# EAGLE design plus2 sram (EAGLE 9.0.1)
PROJECT_NAME: ZX Spectrum +2 (Grey) SRAM replacement
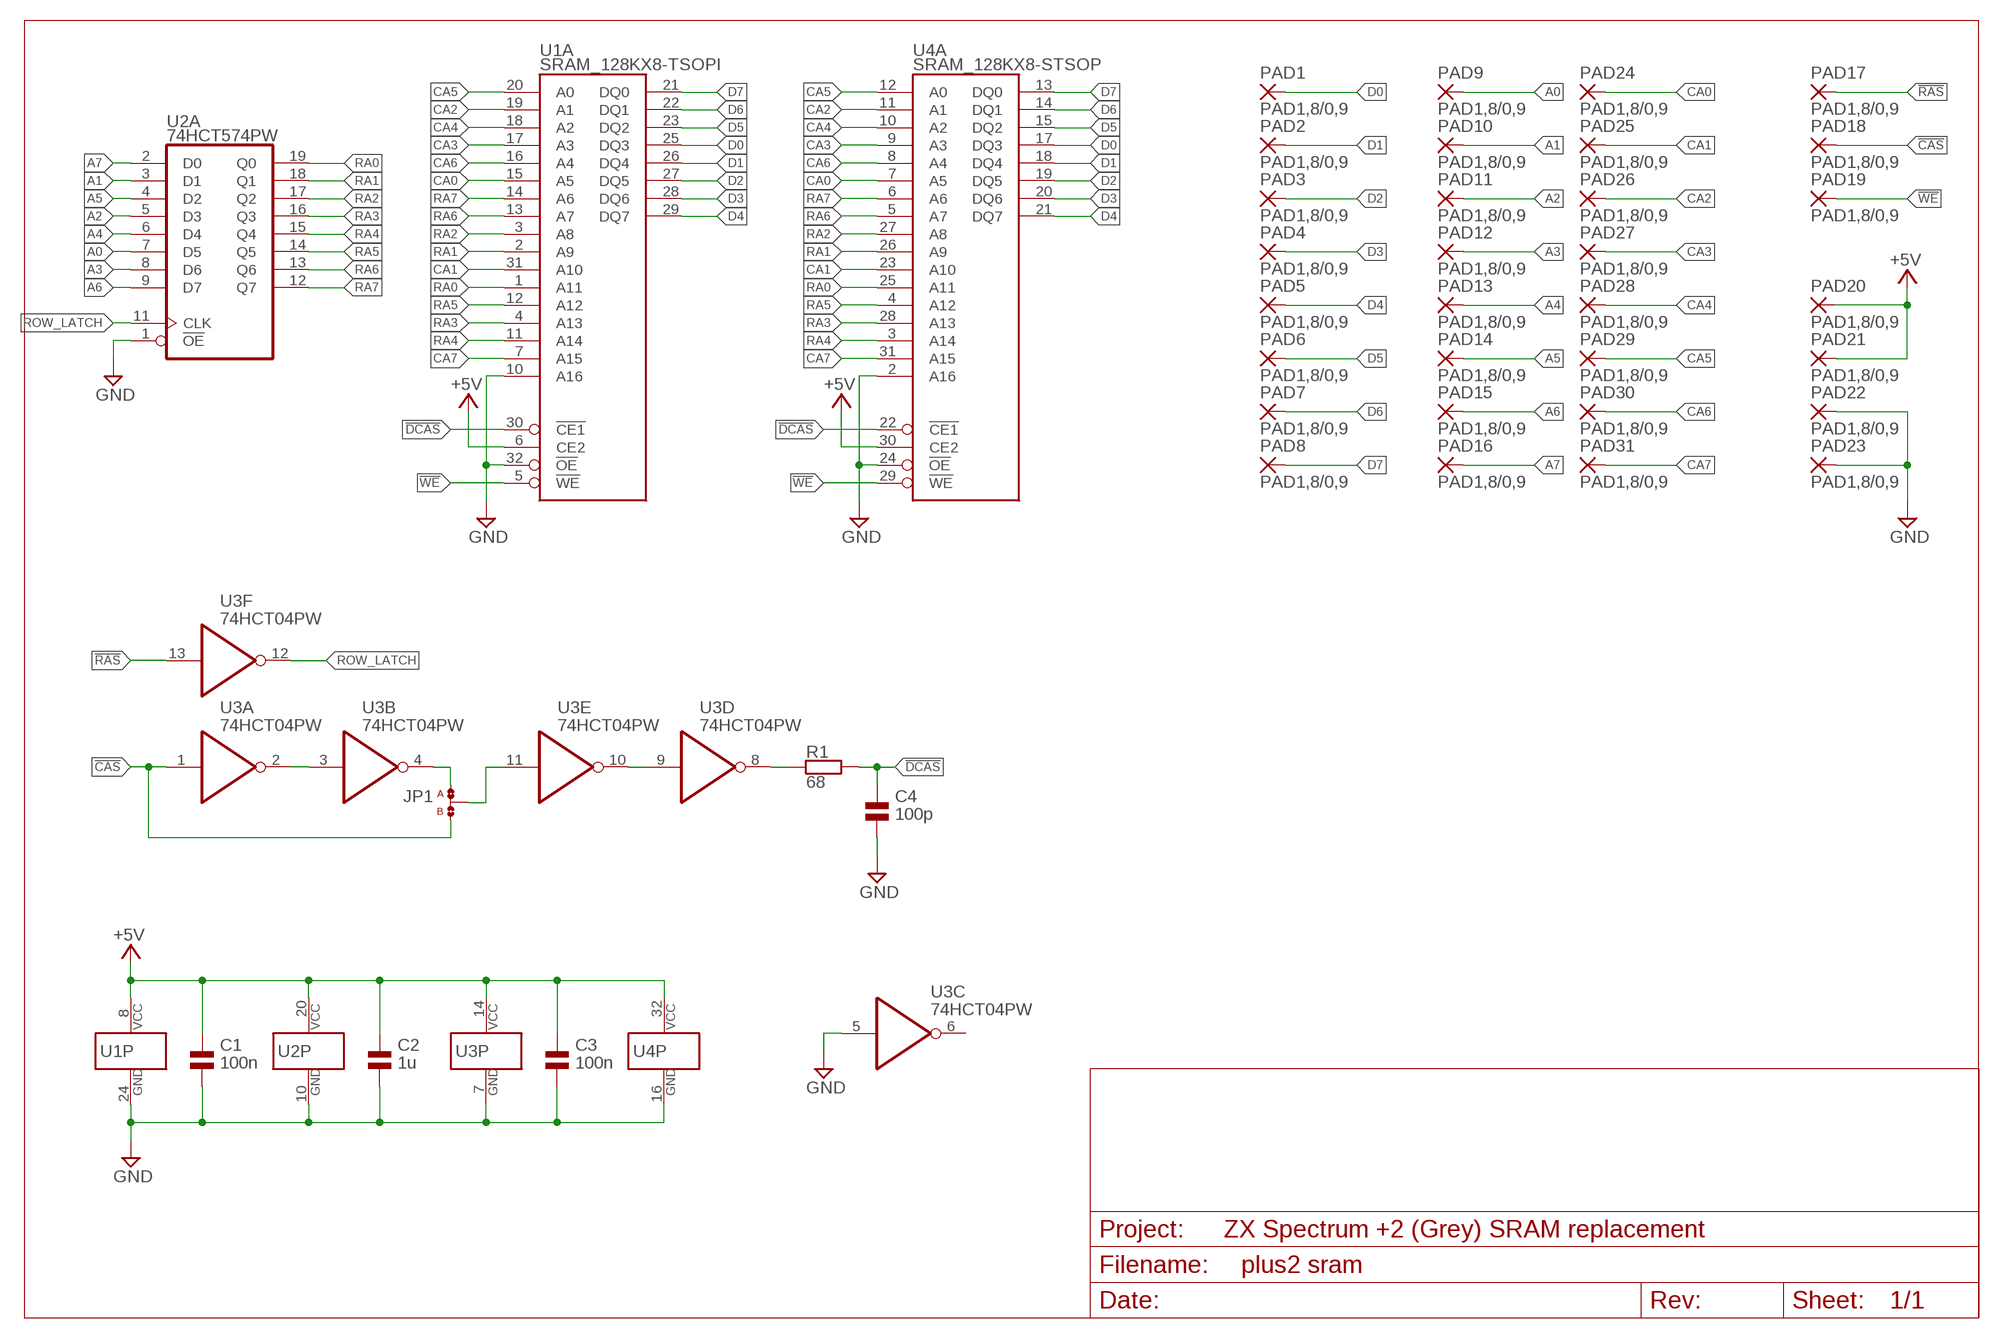
[diagram p0: schematic, sheet 1]

## Parts
C1  100n  CAP_NPOL-0603  [0603]
C2  1u  CAP_NPOL-0603  [0603]
C3  100n  CAP_NPOL-0603  [0603]
C4  100p  CAP_NPOL-0603  [0603]
JP1  JMP-SMD-3W0805  [SJ-3P-0805]
PAD1  PAD1,8/0,9  [1,8/0,9]
PAD2  PAD1,8/0,9  [1,8/0,9]
PAD3  PAD1,8/0,9  [1,8/0,9]
PAD4  PAD1,8/0,9  [1,8/0,9]
PAD5  PAD1,8/0,9  [1,8/0,9]
PAD6  PAD1,8/0,9  [1,8/0,9]
PAD7  PAD1,8/0,9  [1,8/0,9]
PAD8  PAD1,8/0,9  [1,8/0,9]
PAD9  PAD1,8/0,9  [1,8/0,9]
PAD10  PAD1,8/0,9  [1,8/0,9]
PAD11  PAD1,8/0,9  [1,8/0,9]
PAD12  PAD1,8/0,9  [1,8/0,9]
PAD13  PAD1,8/0,9  [1,8/0,9]
PAD14  PAD1,8/0,9  [1,8/0,9]
PAD15  PAD1,8/0,9  [1,8/0,9]
PAD16  PAD1,8/0,9  [1,8/0,9]
PAD17  PAD1,8/0,9  [1,8/0,9]
PAD18  PAD1,8/0,9  [1,8/0,9]
PAD19  PAD1,8/0,9  [1,8/0,9]
PAD20  PAD1,8/0,9  [1,8/0,9]
PAD21  PAD1,8/0,9  [1,8/0,9]
PAD22  PAD1,8/0,9  [1,8/0,9]
PAD23  PAD1,8/0,9  [1,8/0,9]
PAD24  PAD1,8/0,9  [1,8/0,9]
PAD25  PAD1,8/0,9  [1,8/0,9]
PAD26  PAD1,8/0,9  [1,8/0,9]
PAD27  PAD1,8/0,9  [1,8/0,9]
PAD28  PAD1,8/0,9  [1,8/0,9]
PAD29  PAD1,8/0,9  [1,8/0,9]
PAD30  PAD1,8/0,9  [1,8/0,9]
PAD31  PAD1,8/0,9  [1,8/0,9]
R1  68  RES-SMD_0603  [0603]
U1  SRAM_128KX8-TSOPI  [TSOP-I-32]
U2  74HCT574PW  [TSSOP20]
U3  74HCT04PW  [TSSOP14]
U4  SRAM_128KX8-STSOP  [STSOP-32]

## Nets
!CAS: JP1.B PAD18.1(P) U3.1(A:I)
!DCAS: C4.1 R1.2 U1.30(A:!CE1) U4.22(A:!CE1)
!RAS: PAD17.1(P) U3.13(F:I)
!WE: PAD19.1(P) U1.5(A:!WE) U4.29(A:!WE)
+5V: C1.1 C2.1 C3.1 PAD20.1(P) PAD21.1(P) U1.6(A:CE2) U1.8(P:VCC) U2.20(P:VCC) U3.14(P:VCC) U4.30(A:CE2) U4.32(P:VCC)
A0: PAD9.1(P) U2.7(A:D5)
A1: PAD10.1(P) U2.3(A:D1)
A2: PAD11.1(P) U2.5(A:D3)
A3: PAD12.1(P) U2.8(A:D6)
A4: PAD13.1(P) U2.6(A:D4)
A5: PAD14.1(P) U2.4(A:D2)
A6: PAD15.1(P) U2.9(A:D7)
A7: PAD16.1(P) U2.2(A:D0)
CA0: PAD24.1(P) U1.15(A:A5) U4.7(A:A5)
CA1: PAD25.1(P) U1.31(A:A10) U4.23(A:A10)
CA2: PAD26.1(P) U1.19(A:A1) U4.11(A:A1)
CA3: PAD27.1(P) U1.17(A:A3) U4.9(A:A3)
CA4: PAD28.1(P) U1.18(A:A2) U4.10(A:A2)
CA5: PAD29.1(P) U1.20(A:A0) U4.12(A:A0)
CA6: PAD30.1(P) U1.16(A:A4) U4.8(A:A4)
CA7: PAD31.1(P) U1.7(A:A15) U4.31(A:A15)
D0: PAD1.1(P) U1.25(A:DQ3) U4.17(A:DQ3)
D1: PAD2.1(P) U1.26(A:DQ4) U4.18(A:DQ4)
D2: PAD3.1(P) U1.27(A:DQ5) U4.19(A:DQ5)
D3: PAD4.1(P) U1.28(A:DQ6) U4.20(A:DQ6)
D4: PAD5.1(P) U1.29(A:DQ7) U4.21(A:DQ7)
D5: PAD6.1(P) U1.23(A:DQ2) U4.15(A:DQ2)
D6: PAD7.1(P) U1.22(A:DQ1) U4.14(A:DQ1)
D7: PAD8.1(P) U1.21(A:DQ0) U4.13(A:DQ0)
GND: C1.2 C2.2 C3.2 C4.2 PAD22.1(P) PAD23.1(P) U1.10(A:A16) U1.24(P:GND) U1.32(A:!OE) U2.1(A:!OE) U2.10(P:GND) U3.5(C:I) U3.7(P:GND) U4.2(A:A16) U4.16(P:GND) U4.24(A:!OE)
N$1: R1.1 U3.8(D:O)
N$2: U3.2(A:O) U3.3(B:I)
N$3: JP1.COM U3.11(E:I)
N$4: U3.9(D:I) U3.10(E:O)
N$5: JP1.A U3.4(B:O)
RA0: U1.1(A:A11) U2.19(A:Q0) U4.25(A:A11)
RA1: U1.2(A:A9) U2.18(A:Q1) U4.26(A:A9)
RA2: U1.3(A:A8) U2.17(A:Q2) U4.27(A:A8)
RA3: U1.4(A:A13) U2.16(A:Q3) U4.28(A:A13)
RA4: U1.11(A:A14) U2.15(A:Q4) U4.3(A:A14)
RA5: U1.12(A:A12) U2.14(A:Q5) U4.4(A:A12)
RA6: U1.13(A:A7) U2.13(A:Q6) U4.5(A:A7)
RA7: U1.14(A:A6) U2.12(A:Q7) U4.6(A:A6)
ROW_LATCH: U2.11(A:CLK) U3.12(F:O)
Unconnected: U3.6(C:O)

## Library data of the parts
C1-C4 = jc-passive:CAP_NPOL
JP1 = jc-jumper:JMP-SMD-3W
PAD1-PAD31 = jc-connectors:PAD: Wire PAD connect wire on PCB
R1 = jc-passive:RES
U1 U4 = jc-memories:SRAM_128KX8: 628128-type CMOS Static RAM, 1Mbit, 128kx8 Cypress CY62128 ISSI IS61C1024AL, IS64C1024AL Alliance AS6C1008 Hitachi HM62812D
U2 = jc-logic:74*574: Octal D-type flip-flop; positive edge-trigger; 3-state
U3 = jc-logic:74*04: Hex Inverters

## Board
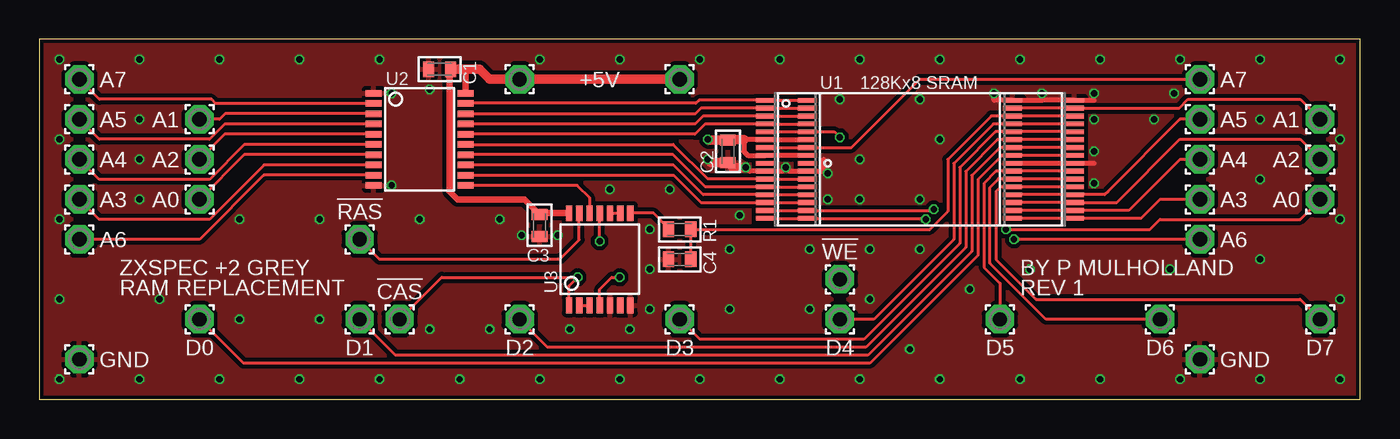
[diagram p1: board, top side]
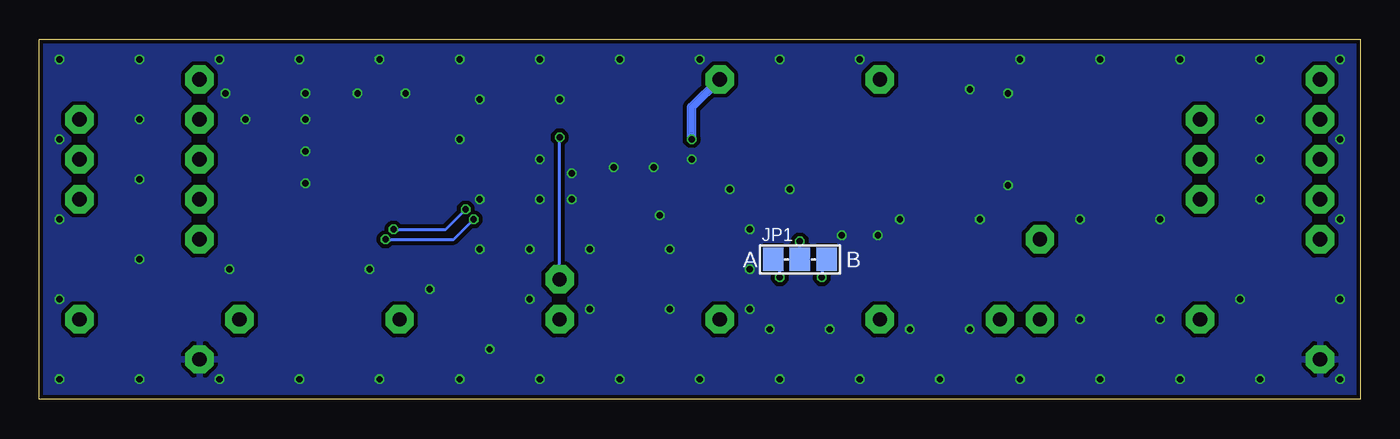
[diagram p2: board, bottom side, seen from below]

Size 83.82 x 22.86 mm. Coordinates in mm from the lower left corner, seen from the top.
Outline: 0,0 83.82,0 83.82,22.86 0,22.86 0,0
Copper layers (1*16): Top 0.035mm / dielectric 0.2mm / Bottom 0.035mm
Design rules "jlcpcb-2layers": minimum track width 3.5mil, minimum drill 0.2mm, track to track 5mil, track to pad 5mil, pad to pad 5mil, via to via 5mil, smd to smd 0mil, copper to edge 0.1mm, drill to drill 5mil, minimum pad ring 4mil, minimum via ring 4mil, stop-mask expansion 3mil, vias tented up to drill 100mil, thermal gap 10mil

### Footprints (pad centres in the part's own frame; a part is rotated, then mirrored left to right if it is on the bottom)
0603 = smd 0.7 x 1: 1 -0.7,0; 2 0.7,0
SJ-3P-0805 = smd 1.3 x 1.5: A -1.7,0; B 1.7,0; COM 0,0
1,8/0,9 = drill 0.9 pad 1.8 octagon: 1 0,0
TSOP-I-32 = smd 1.21 x 0.3: 1 -9.805,3.75; 2 -9.805,3.25; 3 -9.805,2.75; 4 -9.805,2.25; 5 -9.805,1.75; 6 -9.805,1.25; 7 -9.805,0.75; 8 -9.805,0.25; 9 -9.805,-0.25; 10 -9.805,-0.75; 11 -9.805,-1.25; 12 -9.805,-1.75; 13 -9.805,-2.25; 14 -9.805,-2.75; 15 -9.805,-3.25; 16 -9.805,-3.75; 17 9.805,-3.75; 18 9.805,-3.25; 19 9.805,-2.75; 20 9.805,-2.25; 21 9.805,-1.75; 22 9.805,-1.25; 23 9.805,-0.75; 24 9.805,-0.25; 25 9.805,0.25; 26 9.805,0.75; 27 9.805,1.25; 28 9.805,1.75; 29 9.805,2.25; 30 9.805,2.75; 31 9.805,3.25; 32 9.805,3.75
TSSOP20 = smd 0.4 x 1: 1 -2.925,-2.925; 2 -2.275,-2.925; 3 -1.625,-2.925; 4 -0.975,-2.925; 5 -0.325,-2.925; 6 0.325,-2.925; 7 0.975,-2.925; 8 1.625,-2.925; 9 2.275,-2.925; 10 2.925,-2.925; 11 2.925,2.925; 12 2.275,2.925; 13 1.625,2.925; 14 0.975,2.925; 15 0.325,2.925; 16 -0.325,2.925; 17 -0.975,2.925; 18 -1.625,2.925; 19 -2.275,2.925; 20 -2.925,2.925
TSSOP14 = smd 0.4 x 1: 1 -1.95,-2.925; 2 -1.3,-2.925; 3 -0.65,-2.925; 4 0,-2.925; 5 0.65,-2.925; 6 1.3,-2.925; 7 1.95,-2.925; 8 1.95,2.925; 9 1.3,2.925; 10 0.65,2.925; 11 0,2.925; 12 -0.65,2.925; 13 -1.3,2.925; 14 -1.95,2.925
STSOP-32 = smd 1.21 x 0.3: 1 -6.505,-0.25; 2 -6.505,-0.75; 3 -6.505,-1.25; 4 -6.505,-1.75; 5 -6.505,-2.25; 6 -6.505,-2.75; 7 -6.505,-3.25; 8 -6.505,-3.75; 9 6.505,-3.75; 10 6.505,-3.25; 11 6.505,-2.75; 12 6.505,-2.25; 13 6.505,-1.75; 14 6.505,-1.25; 15 6.505,-0.75; 16 6.505,-0.25; 17 6.505,0.25; 18 6.505,0.75; 19 6.505,1.25; 20 6.505,1.75; 21 6.505,2.25; 22 6.505,2.75; 23 6.505,3.25; 24 6.505,3.75; 25 -6.505,3.75; 26 -6.505,3.25; 27 -6.505,2.75; 28 -6.505,2.25; 29 -6.505,1.75; 30 -6.505,1.25; 31 -6.505,0.75; 32 -6.505,0.25

### Placement (x,y rotation side)
C1  25.4,20.95 180 top
C2  43.69,15.75 270 top
C3  31.75,11.05 270 top
C4  40.64,8.89 180 top
JP1  35.56,8.89 0 bottom
PAD1  10.16,5.08 0 top
PAD2  20.32,5.08 0 top
PAD3  30.48,5.08 0 top
PAD4  40.64,5.08 0 top
PAD5  50.8,5.08 0 top
PAD6  60.96,5.08 0 top
PAD7  71.12,5.08 0 top
PAD8  81.28,5.08 0 top
PAD9  10.16,12.7 0 top
PAD10  10.16,17.78 0 top
PAD11  10.16,15.24 0 top
PAD12  2.54,12.7 0 top
PAD13  2.54,15.24 0 top
PAD14  2.54,17.78 0 top
PAD15  2.54,10.16 0 top
PAD16  2.54,20.32 0 top
PAD17  20.32,10.16 0 top
PAD18  22.86,5.08 0 top
PAD19  50.8,7.62 0 top
PAD20  30.48,20.32 0 top
PAD21  40.64,20.32 0 top
PAD22  2.54,2.54 0 top
PAD23  73.66,2.54 0 top
PAD24  81.28,12.7 0 top
PAD25  81.28,17.78 0 top
PAD26  81.28,15.24 0 top
PAD27  73.66,12.7 0 top
PAD28  73.66,15.24 0 top
PAD29  73.66,17.78 0 top
PAD30  73.66,10.16 0 top
PAD31  73.66,20.32 0 top
R1  40.64,10.79 0 top
U1  55.88,15.24 0 top
U2  24.13,16.51 270 top
U3  35.56,8.89 0 top
U4  55.24,15.24 0 top

### Tracks (layer width: path | path; a pad name or v marks a point on that pad's centre or on a via)
!CAS  (via drill 0.4)
  Top 0.203: PAD18.1 25.53,7.75 v34.16,7.75 33.61,7.19 U3.1
  Bottom 0.203: JP1.B 34.16,8.89 v34.16,7.75
!DCAS
  Top 0.203: C4.1 R1.2 56.52,10.79 57.66,11.94 57.66,15.24 60.41,17.99 U4.22 U1.30
!RAS
  Top 0.203: PAD17.1 21.59,8.89 33.02,8.89 34.26,10.13 U3.13
!WE  (via drill 0.4)
  Top 0.203: U1.5 U4.29 50.45,16.99 v50.8,16.64
  Bottom 0.203: PAD19.1 v50.8,16.64
+5V  (via drill 0.4)
  Top 0.305: U4.30 U1.6 44.71,16.49 44.71,15.74 44.96,15.49 U1.8 U4.32
  Top 0.406: U3.14 31.75,11.81 C3.1 30.8,12.7 26.54,12.7 26.04,13.21 26.04,20.89 C1.1 | U2.20 27.05,20.95
  Top 0.61: PAD21.1 PAD20.1 28.57,20.32 27.94,20.95 27.05,20.95 C1.1 | 44.71,16.49 43.71,16.49 43.71,16.45 C2.1 42.48,16.45 v42.42,16.51
  Bottom 0.61: v42.42,16.51 42.42,18.54 PAD21.1
A0
  Top 0.203: U2.7 12.99,15.54 PAD9.1
A1
  Top 0.203: PAD10.1 11.43,17.78 11.79,18.14 U2.3
A2
  Top 0.203: U2.5 11.76,16.84 PAD11.1
A3
  Top 0.203: PAD12.1 3.81,11.43 10.79,11.43 14.25,14.88 U2.8
A4
  Top 0.203: PAD13.1 3.81,13.97 10.79,13.97 13.01,16.18 U2.6
A5
  Top 0.203: PAD14.1 3.81,16.51 10.79,16.51 11.77,17.48 U2.4
A6
  Top 0.203: PAD15.1 10.16,10.16 14.23,14.23 U2.9
A7
  Top 0.203: PAD16.1 3.81,19.05 10.92,19.05 11.19,18.79 U2.2
CA0  (via drill 0.4)
  Top 0.203: PAD24.1 80.01,11.43 71.12,11.43 70.48,10.79 v61.34,10.79 | U1.15 U4.7 56.77,11.99 v56.77,12.06
  Bottom 0.203: v61.34,10.79 58.04,10.79 v56.77,12.06
CA1
  Top 0.203: PAD25.1 80.01,19.05 72.9,19.05 72.34,18.49 U1.31 U4.23
CA2
  Top 0.203: PAD26.1 80.01,16.51 72.39,16.51 68.37,12.49 U1.19 U4.11
CA3
  Top 0.203: PAD27.1 71.12,12.7 69.91,11.49 U1.17 U4.9
CA4
  Top 0.203: PAD28.1 72.39,15.24 69.14,11.99 U1.18 U4.10
CA5
  Top 0.203: PAD29.1 72.39,17.78 67.83,13.22 67.83,13.21 67.6,12.99 U1.20 U4.12
CA6  (via drill 0.4)
  Top 0.203: PAD30.1 v61.85,10.16 | U1.16 U4.8 56.2,11.49 v56.26,11.43
  Bottom 0.203: v61.85,10.16 57.53,10.16 v56.26,11.43
CA7
  Top 0.203: PAD31.1 55.88,20.32 51.55,15.99 U4.31 U1.7
D0
  Top 0.203: PAD1.1 12.95,2.29 52.7,2.29 59.56,9.14 59.56,13.97 61.08,15.49 U4.17 U1.25
D1
  Top 0.203: PAD2.1 22.61,2.79 52.58,2.79 59.18,9.4 59.18,14.22 60.95,15.99 U4.18 U1.26
D2
  Top 0.203: PAD3.1 32.26,3.3 52.45,3.3 58.8,9.65 58.8,14.48 60.81,16.49 U4.19 U1.27
D3
  Top 0.203: PAD4.1 41.91,3.81 52.32,3.81 58.42,9.91 58.42,14.73 60.68,16.99 U4.20 U1.28
D4
  Top 0.203: PAD5.1 52.96,5.08 58.04,10.16 58.04,14.99 60.54,17.49 U4.21 U1.29
D5
  Top 0.203: U1.23 U4.15 60.72,14.49 59.94,13.72 59.94,8.38 60.96,7.37 PAD6.1
D6
  Top 0.203: U1.22 U4.14 60.85,13.99 60.33,13.46 60.33,8.64 63.88,5.08 PAD7.1
D7
  Top 0.203: PAD8.1 80.01,6.35 63.25,6.35 60.71,8.89 60.71,13.21 60.99,13.49 U4.13 U1.21
GND  (via drill 0.4)
  Top 0.305: 66.93,14.99 U1.24 U4.16 | v44.83,14.73 45.07,14.49 U1.10 47.13,14.49 v47.37,14.73 47.61,14.49 U4.2 49.78,14.49 49.78,15.24 | v60.58,19.43 60.58,18.99 U4.24 63.63,18.99 | 63.63,18.99 U1.32 66.93,18.99 v66.93,19.43 | 63.63,18.99 v63.63,19.43
  Top 0.61: v44.83,14.73 44,14.73 C2.2 42.61,15.05 v42.42,15.24
  other vias: 66.93,13.72 22.35,13.59 22.35,19.43 52.7,9.53 37.47,4.45 32.89,10.41 30.61,10.41 38.73,10.79 6.35,1.27 11.43,1.27 16.51,1.27 21.59,1.27 26.67,1.27 31.75,1.27 36.83,1.27 41.91,1.27 46.99,1.27 52.07,1.27 57.15,1.27 62.23,1.27 67.31,1.27 72.39,1.27 77.47,1.27 82.55,1.27 1.27,1.27 6.35,21.59 11.43,21.59 16.51,21.59 21.59,21.59 31.75,21.59 36.83,21.59 41.91,21.59 46.99,21.59 52.07,21.59 57.15,21.59 62.23,21.59 67.31,21.59 72.39,21.59 77.47,21.59 82.55,21.59 1.27,21.59 38.73,5.71 48.9,9.53 48.9,5.71 24.77,19.68 6.35,17.78 6.35,15.24 6.35,12.7 77.47,17.78 77.47,13.97 36.2,13.34 40.01,13.34 50.04,14.35 50.04,12.7 52.07,15.24 55.88,12.7 55.88,19.05 57.15,16.51 50.8,19.05 66.93,17.78 70.74,17.78 66.93,15.75 82.55,6.35 82.55,11.43 82.55,16.51 1.27,6.35 1.27,11.43 1.27,16.51 44.45,11.68 38.73,8.26 43.81,9.53 43.81,5.71 59.05,6.99 72.01,19.43 24.13,11.43 29.21,11.43 12.7,11.43 17.78,11.43 12.7,5.08 17.78,5.08 7.62,6.35 62.87,8.26 71.75,8.26 77.47,8.89 24.77,4.45 28.57,4.45 33.66,4.45 55.88,9.53 52.7,6.35 55.24,3.17 52.07,12.7
  pour Top (isolate 0.254): 0,0 83.82,0 83.82,22.86 0,22.86
  pour Bottom (isolate 0.254): 0,0 83.82,0 83.82,22.86 0,22.86
N$1
  Top 0.203: U3.8 38.98,11.81 39.94,10.86 R1.1
N$2
  Top 0.203: U3.2 U3.3
N$3  (via drill 0.4)
  Top 0.203: v35.56,10.03 U3.11
  Bottom 0.203: JP1.COM v35.56,10.03
N$4
  Top 0.203: U3.10 U3.9
N$5  (via drill 0.4)
  Top 0.203: U3.4 35.56,6.99 36.32,7.75 v36.83,7.75
  Bottom 0.203: v36.83,7.75 36.83,8.89 JP1.A
RA0
  Top 0.203: U2.19 27.07,18.8 41.66,18.8 41.85,18.99 U1.1 U4.25
RA1
  Top 0.203: U2.18 41.63,18.14 41.98,18.49 U1.2 U4.26
RA2
  Top 0.203: U2.17 41.62,17.48 42.12,17.99 U1.3 U4.27
RA3
  Top 0.203: U2.16 41.6,16.84 42.26,17.49 U1.4 U4.28
RA4
  Top 0.203: U2.15 40.22,16.18 42.42,13.99 U1.11 U4.3
RA5
  Top 0.203: U2.14 40.22,15.54 42.26,13.49 U1.12 U4.4
RA6
  Top 0.203: U2.13 40.23,14.88 42.13,12.99 U1.13 U4.5
RA7
  Top 0.203: U2.12 40.25,14.23 41.99,12.49 U1.14 U4.6
ROW_LATCH
  Top 0.203: U2.11 34.14,13.59 34.91,12.81 U3.12

### Text on the board
tPlace: A7 | +5V | 128Kx8 SRAM | A7 | A5 | A1 | A5 | A1 | A4 | A2 | A4 | A2 | A3 | A0 | A3 | A0 | !RAS | A6 | A6 | ZXSPEC +2 GREY | !WE | BY P MULHOLLAND | RAM REPLACEMENT | REV 1 | !CAS | D0 | D1 | D2 | D3 | D4 | D5 | D6 | D7 | GND | GND